# Altium project PCB_Project1.PrjPCB
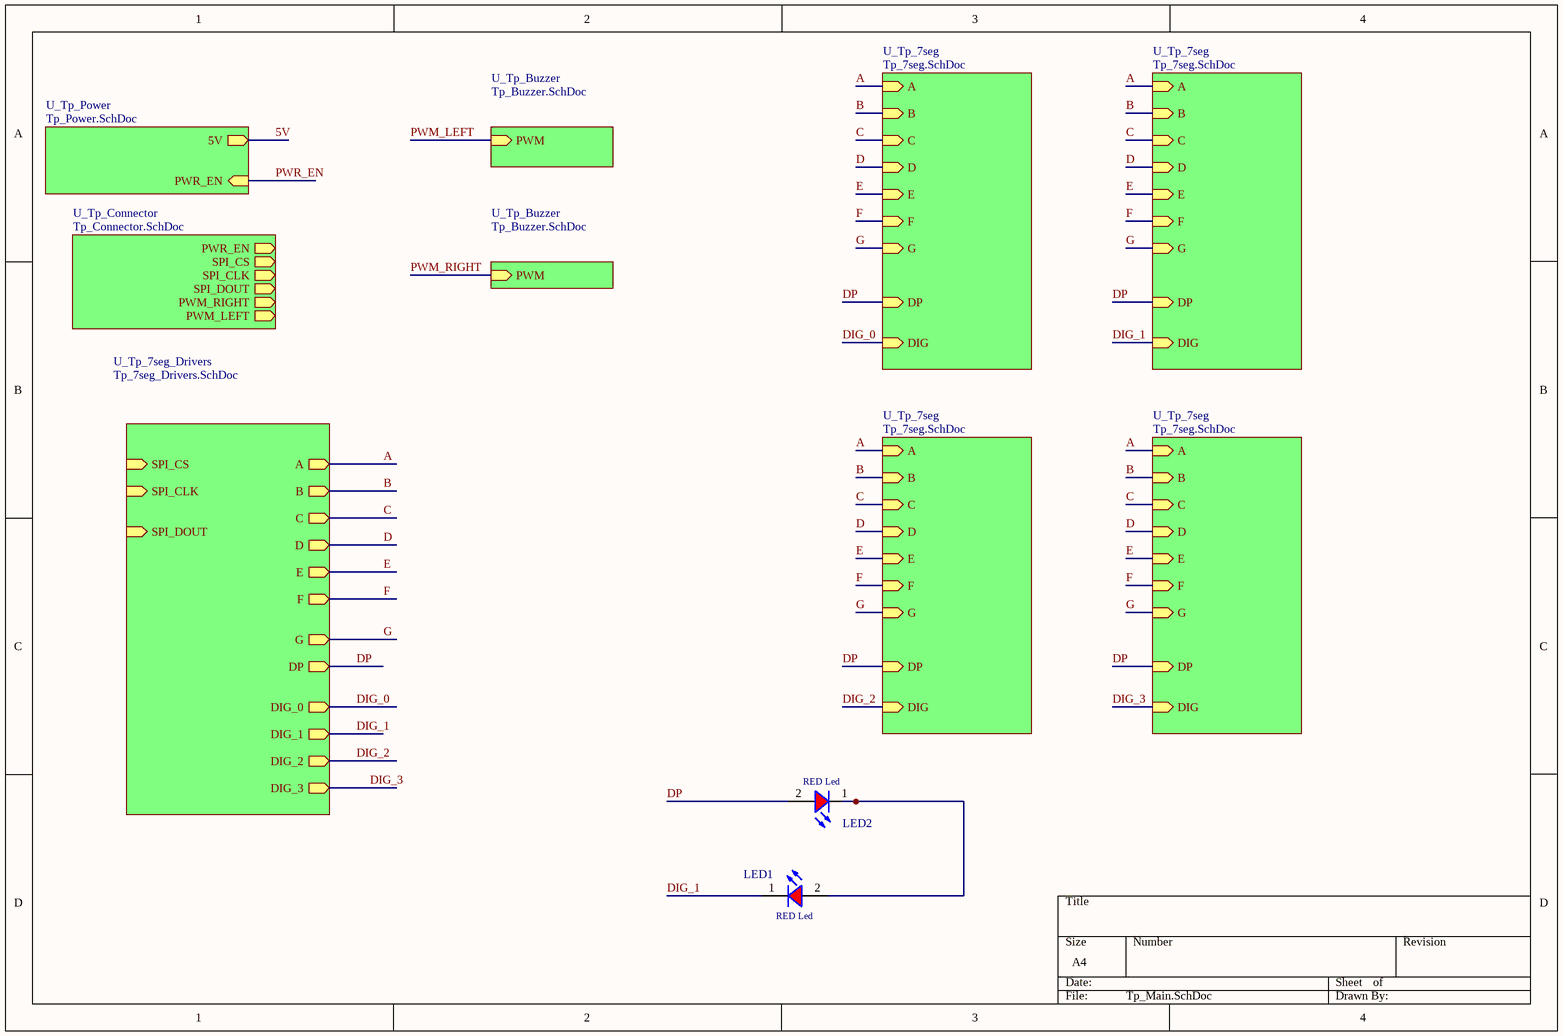
[diagram p0: Tp_Main.SchDoc]
6 sheets, 55 parts. Net scope: hierarchical (ports join the sheet entries above them; power ports are global).
Sheets:
  Tp_Main.SchDoc
    U_Tp_Buzzer = Tp_Buzzer.SchDoc
    U_Tp_7seg = Tp_7seg.SchDoc
    U_Tp_Buzzer = Tp_Buzzer.SchDoc
    U_Tp_7seg = Tp_7seg.SchDoc
    U_Tp_7seg = Tp_7seg.SchDoc
    U_Tp_7seg = Tp_7seg.SchDoc
    U_Tp_Power = Tp_Power.SchDoc
    U_Tp_7seg_Drivers = Tp_7seg_Drivers.SchDoc
    U_Tp_Connector = Tp_Connector.SchDoc

## Sheet Tp_Main.SchDoc
size A4

### Parts
LED1  RED Led  [LED_0603_RED]
LED2  RED Led  [LED_0603_RED]

### Sub-sheets
U_Tp_7seg = Tp_7seg.SchDoc: A (in), B (in), C (in), D (in), E (in), F (in), G (in), DP (in), DIG (in)
U_Tp_7seg = Tp_7seg.SchDoc: A (in), B (in), C (in), D (in), E (in), F (in), G (in), DP (in), DIG (in)
U_Tp_7seg = Tp_7seg.SchDoc: A (in), B (in), C (in), D (in), E (in), F (in), G (in), DP (in), DIG (in)
U_Tp_7seg = Tp_7seg.SchDoc: A (in), B (in), C (in), D (in), E (in), F (in), G (in), DP (in), DIG (in)
U_Tp_7seg_Drivers = Tp_7seg_Drivers.SchDoc: D (out), B (out), C (out), E (out), F (out), G (out), DP (out), A (out), DIG_0 (out), DIG_1 (out), DIG_2 (out), DIG_3 (out), SPI_CS (in), SPI_CLK (in), SPI_DOUT (in)
U_Tp_Buzzer = Tp_Buzzer.SchDoc: PWM (in)
U_Tp_Buzzer = Tp_Buzzer.SchDoc: PWM (in)
U_Tp_Connector = Tp_Connector.SchDoc: PWR_EN (out), SPI_CS (out), SPI_CLK (out), SPI_DOUT (out), PWM_RIGHT (out), PWM_LEFT (out)
U_Tp_Power = Tp_Power.SchDoc: 5V (out), PWR_EN (in)

### Nets
5V: sheet U_Tp_Power/5V
A: sheet U_Tp_7seg/A, sheet U_Tp_7seg/A, sheet U_Tp_7seg/A, sheet U_Tp_7seg/A, sheet U_Tp_7seg_Drivers/A
B: sheet U_Tp_7seg/B, sheet U_Tp_7seg/B, sheet U_Tp_7seg/B, sheet U_Tp_7seg/B, sheet U_Tp_7seg_Drivers/B
C: sheet U_Tp_7seg/C, sheet U_Tp_7seg/C, sheet U_Tp_7seg/C, sheet U_Tp_7seg/C, sheet U_Tp_7seg_Drivers/C
D: sheet U_Tp_7seg/D, sheet U_Tp_7seg/D, sheet U_Tp_7seg/D, sheet U_Tp_7seg/D, sheet U_Tp_7seg_Drivers/D
DIG_0: sheet U_Tp_7seg/DIG, sheet U_Tp_7seg_Drivers/DIG_0
DIG_1: LED1.1(K) ; sheet U_Tp_7seg/DIG, sheet U_Tp_7seg_Drivers/DIG_1
DIG_2: sheet U_Tp_7seg/DIG, sheet U_Tp_7seg_Drivers/DIG_2
DIG_3: sheet U_Tp_7seg/DIG, sheet U_Tp_7seg_Drivers/DIG_3
DP: LED2.2(A) ; sheet U_Tp_7seg/DP, sheet U_Tp_7seg/DP, sheet U_Tp_7seg/DP, sheet U_Tp_7seg/DP, sheet U_Tp_7seg_Drivers/DP
E: sheet U_Tp_7seg/E, sheet U_Tp_7seg/E, sheet U_Tp_7seg/E, sheet U_Tp_7seg/E, sheet U_Tp_7seg_Drivers/E
F: sheet U_Tp_7seg/F, sheet U_Tp_7seg/F, sheet U_Tp_7seg/F, sheet U_Tp_7seg/F, sheet U_Tp_7seg_Drivers/F
G: sheet U_Tp_7seg/G, sheet U_Tp_7seg/G, sheet U_Tp_7seg/G, sheet U_Tp_7seg/G, sheet U_Tp_7seg_Drivers/G
NetLED1_2: LED1.2(A) LED2.1(K)

### Library data of the parts
LED1 LED2 = LED_RED_SMD_WE_150060RS750x0: LED RED SMD WE 150060RS750x0; ref: 150060RS750x0

## Sheet Tp_Buzzer.SchDoc
size A4
Used 2 times, as channels U_Tp_Buzzer, U_Tp_Buzzer. Parts and nets are listed once, with the designators drawn on the sheet.
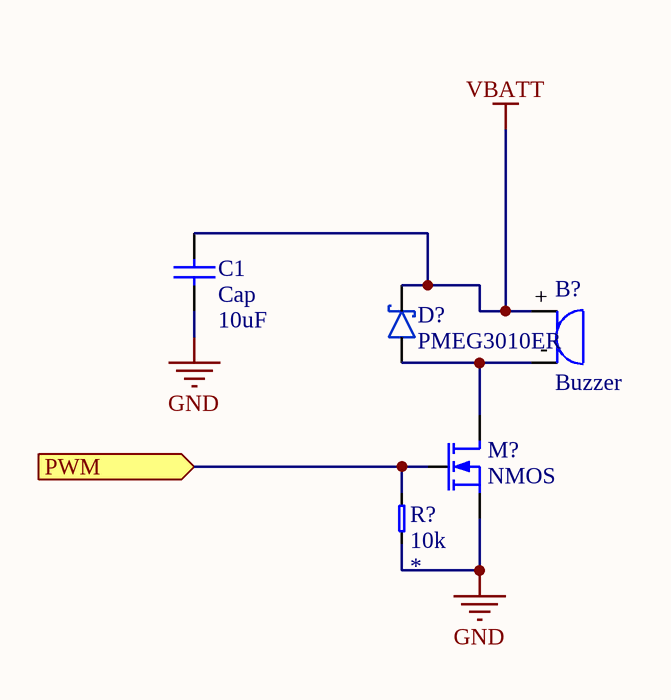
[diagram p1: Tp_Buzzer.SchDoc]

### Parts
B?  Buzzer  [SD160709]
C1  Cap  value 10uF  [RAD-0.3]
D?  PMEG3010ER  [SOD123W]
M?  NMOS  [MOSFET-SOT23]
R?  value 10k  [0603_RES_LD]  (hidden comment: Resistor)

### Ports
PWM (in)

### Nets
GND: C1.1 M?.S R?.1
VBATT: B?.+ C1.2 D?.K
PWM: M?.G R?.2 ; port PWM
NetB?_-: B?.- D?.A M?.D

### Channels
U_Tp_Buzzer: designators end in _U_Tp_Buzzer#1; ports PWM=PWM_LEFT
U_Tp_Buzzer: designators end in _U_Tp_Buzzer#2; ports PWM=PWM_RIGHT

### Library data of the parts
B? = SD160709: TDK SD160709 Buzzer; Reference: SD160709
C1 = Cap: Capacitor; Published: 8-Jun-2000; LatestRevisionDate: 17-Jul-2002; LatestRevisionNote: Re-released for DXP Platform.; PackageReference: RAD-0.3; Publisher: Altium Limited; PackageDescription: Radial Cap, Thru-Hole; 2 Leads; 0.3 in Pin Spacing
D? = Schottky_PMEG3010ER: Nexperia 1A low Vf Mega Schottky barrier rectifier; Reference: PMEG3010ER
M? = N-MOSFET: N MOSFET
R? = Resistor: Precision: *; Package: *

## Sheet Tp_7seg.SchDoc
size A4
Used 4 times, as channels U_Tp_7seg, U_Tp_7seg, U_Tp_7seg, U_Tp_7seg. Parts and nets are listed once, with the designators drawn on the sheet.
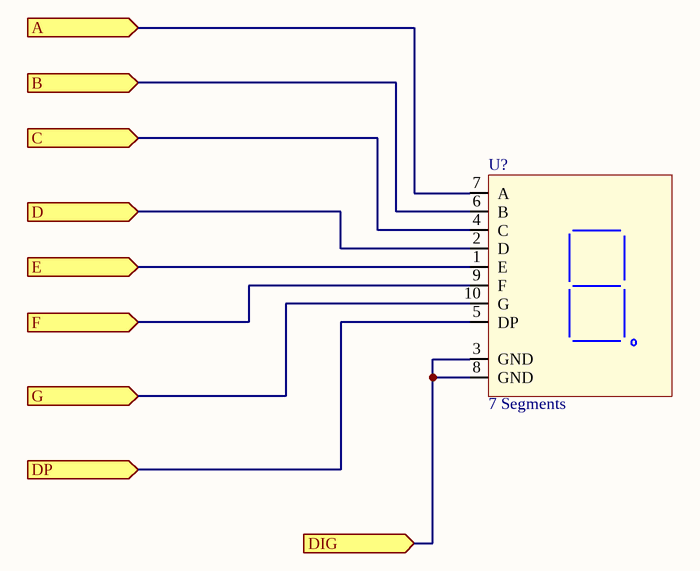
[diagram p2: Tp_7seg.SchDoc]

### Parts
U?  7 Segments  [SA10-21GWA]

### Ports
A (in), B (in), C (in), D (in), DIG (in), DP (in), E (in), F (in), G (in)

### Nets
A: U?.7(A) ; port A
B: U?.6(B) ; port B
C: U?.4(C) ; port C
D: U?.2(D) ; port D
DIG: U?.3(GND) U?.8(GND) ; port DIG
DP: U?.5(DP) ; port DP
E: U?.1(E) ; port E
F: U?.9(F) ; port F
G: U?.10(G) ; port G

### Channels
U_Tp_7seg: designators end in _U_Tp_7seg#1; ports A=A B=B C=C D=D DIG=DIG_2 DP=DP E=E F=F G=G
U_Tp_7seg: designators end in _U_Tp_7seg#2; ports A=A B=B C=C D=D DIG=DIG_1 DP=DP E=E F=F G=G
U_Tp_7seg: designators end in _U_Tp_7seg#3; ports A=A B=B C=C D=D DIG=DIG_3 DP=DP E=E F=F G=G
U_Tp_7seg: designators end in _U_Tp_7seg#4; ports A=A B=B C=C D=D DIG=DIG_0 DP=DP E=E F=F G=G

### Library data of the parts
U? = SC10-21SRWA: KingBright Led 7 Segments; Reference: SC10-21SRWA

## Sheet Tp_Power.SchDoc
size A4
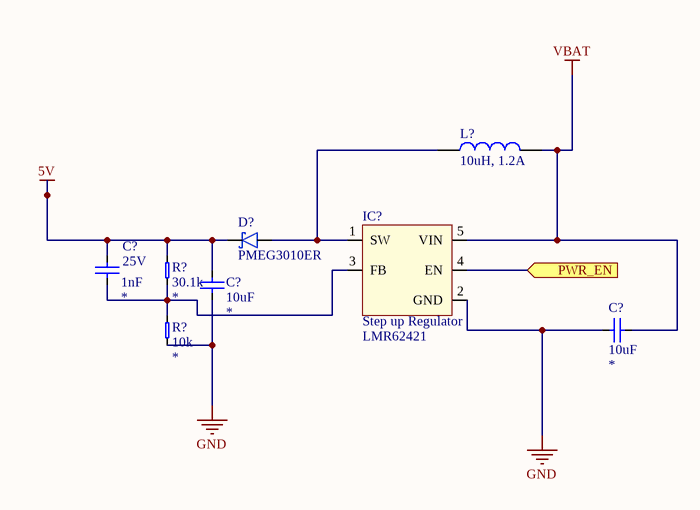
[diagram p3: Tp_Power.SchDoc]

### Parts
(Parts that share a designator on the sheet are numbered #1, #2 ... from top to bottom, then left to right.)
C?#1  value 10uF  [0603_CAP_LD]  (hidden comment: CerCap)
C?#2  value 1nF  Voltage/Power: 25V  [0603_CAP_LD]  (hidden comment: CerCap)
C?#3  value 10uF  [0603_CAP_LD]  (hidden comment: CerCap)
D?  PMEG3010ER  [SOD123W]
IC?#1  Step up Regulator  [LMR62421]
L?  10uH, 1.2A  [INDUCTOR_WE-LQS_5020]
R?#1  value 30.1k  [0603_RES_LD]  (hidden comment: Resistor)
R?#2  value 10k  [0603_RES_LD]  (hidden comment: Resistor)

### Ports
PWR_EN (in)

### Nets
5V: C?#1.2 C?#2.1 D?.K R?#1.2
GND: C?#1.1 C?#3.1 IC?#1.2(GND) R?#2.1
VBAT: C?#3.2 IC?#1.5(VIN) L?.2
PWR_EN: IC?#1.4(EN) ; port PWR_EN
NetC?#2_2: C?#2.2 IC?#1.3(FB) R?#1.1 R?#2.2
NetD?_A: D?.A IC?#1.1(SW) L?.1

### Library data of the parts
C?#1-C?#3 = CerCap: Ceramic Capacitor; Type: *; Package: *
  C?#1 C?#3: Voltage/Power: *
D? = Schottky_PMEG3010ER: as D? on sheet Tp_Buzzer; Reference: PMEG3010ER
IC?#1 = LMR62421XMF: LMR62421 simple switcher 24 Vout stepup voltage SOT-23; Reference: LMR62421
L? = INDUCTOR_74404052100: WE-LQS SMD Power Inductor, size 5020, 10uH, 1.6A; DC Resistance: 109mOhm; Inductance Tolerance: +/-20%; Saturation Current: 1.95A; Self Resonant Frequency: 37MHz; ComponentLink1Description: Manufacturer; ComponentLink1URL: http://www.we-online.de; ComponentLink2Description: Datasheet; ComponentLink2URL: https://katalog.we-online.com/pbs/datasheet/74404052100.pdf; Part Number: 74404052100; Published Date: May 2019; Publisher: Wurth Elektronik; Rated Current: 1.6A; Inductance: 10uH; Operating Temperature: -40 to +125degC; Mounting Technology: SMT; Packaging: Tape and Reel; DC Resistance Tolerance: +/-20%; Size: 5020; Reference: 74404052100
R?#1 R?#2 = Resistor: Precision: *; Package: *

## Sheet Tp_7seg_Drivers.SchDoc
size A4
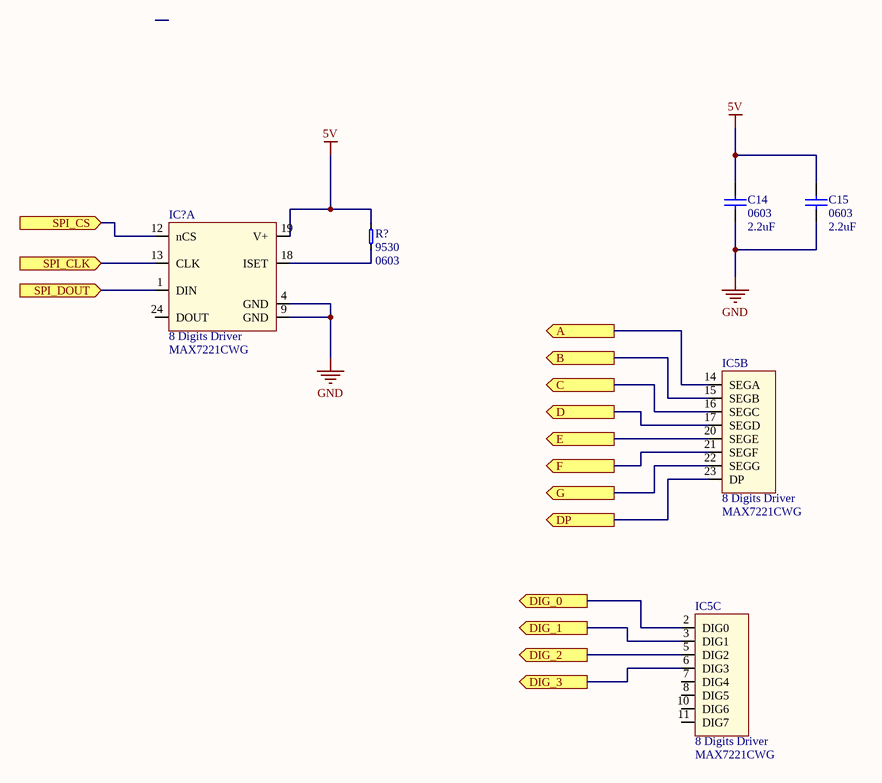
[diagram p4: Tp_7seg_Drivers.SchDoc]

### Parts
(Parts that share a designator on the sheet are numbered #1, #2 ... from top to bottom, then left to right.)
C14#1  0603  value 2.2uF  [RAD-0.3]
C15  0603  value 2.2uF  [RAD-0.3]
IC5  8 Digits Driver  [MAX7221CWG]  (parts B,C of 3)
IC?#2  8 Digits Driver  [MAX7221CWG]  (part A of 3)
R?#3  value 9530  Package: 0603  [0603_RES_LD]  (hidden comment: Resistor)

### Ports
A (out), B (out), C (out), D (out), DIG_0 (out), DIG_1 (out), DIG_2 (out), DIG_3 (out), DP (out), E (out), F (out), G (out), SPI_CLK (in), SPI_CS (in), SPI_DOUT (in)

### Nets
5V: C14#1.2 C15.2 IC?#2.19(V+) R?#3.2
GND: C14#1.1 C15.1 IC?#2.4(GND) IC?#2.9(GND)
A: IC5.14(SEGA) ; port A
B: IC5.15(SEGB) ; port B
C: IC5.16(SEGC) ; port C
D: IC5.17(SEGD) ; port D
DIG_0: IC5.2(DIG0) ; port DIG_0
DIG_1: IC5.3(DIG1) ; port DIG_1
DIG_2: IC5.5(DIG2) ; port DIG_2
DIG_3: IC5.6(DIG3) ; port DIG_3
DP: IC5.23(DP) ; port DP
E: IC5.20(SEGE) ; port E
F: IC5.21(SEGF) ; port F
G: IC5.22(SEGG) ; port G
NetIC?#2_1: IC?#2.1(DIN) ; port SPI_DOUT
NetIC?#2_12: IC?#2.12(nCS) ; port SPI_CS
NetIC?#2_13: IC?#2.13(CLK) ; port SPI_CLK
NetIC?#2_18: IC?#2.18(ISET) R?#3.1

Not connected (* = marked no-connect by the designer): IC5 7(DIG4) 8(DIG5) 10(DIG6) 11(DIG7); IC?#2 24(DOUT)

### Library data of the parts
C14#1 C15 = Cap: Capacitor; Published: 8-Jun-2000; LatestRevisionDate: 17-Jul-2002; LatestRevisionNote: Re-released for DXP Platform.; PackageReference: RAD-0.3; Publisher: Altium Limited; PackageDescription: Radial Cap, Thru-Hole; 2 Leads; 0.3 in Pin Spacing
IC5 IC?#2 = MAX7221: MAX7221 8 Digit 7 Segments Display; Reference: MAX7221CWG
R?#3 = Resistor: Precision: *

## Sheet Tp_Connector.SchDoc
size A4
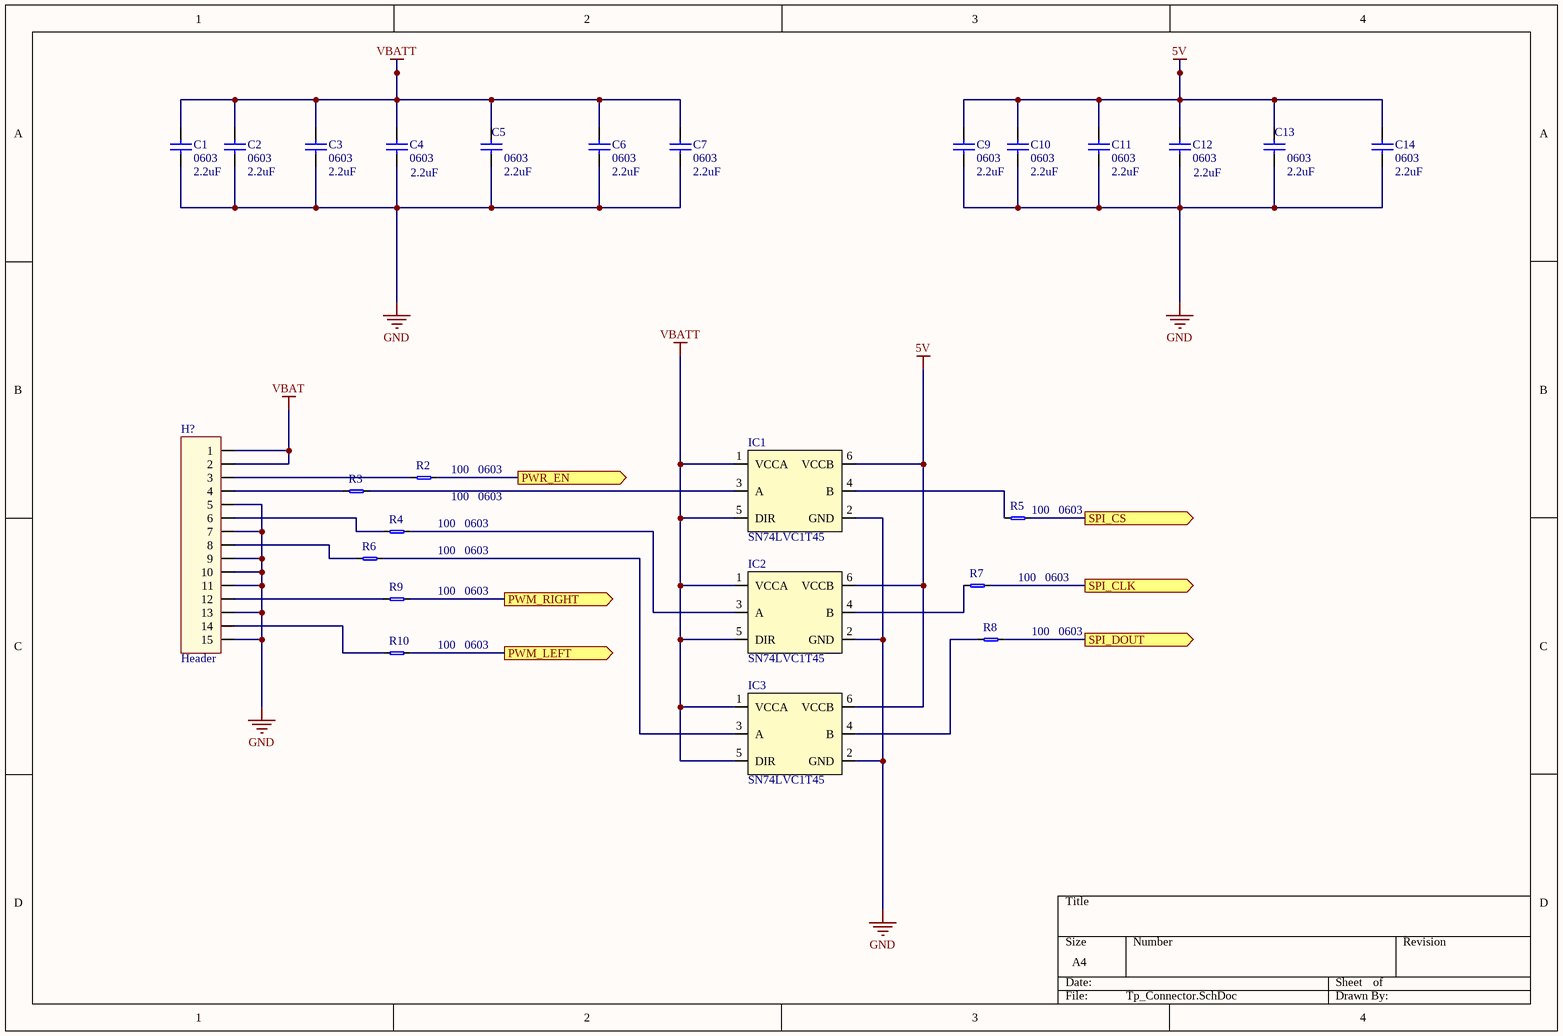
[diagram p5: Tp_Connector.SchDoc]

### Parts
(Parts that share a designator on the sheet are numbered #1, #2 ... from top to bottom, then left to right.)
C1  0603  value 2.2uF  [RAD-0.3]
C2  0603  value 2.2uF  [RAD-0.3]
C3  0603  value 2.2uF  [RAD-0.3]
C4  0603  value 2.2uF  [RAD-0.3]
C5  0603  value 2.2uF  [RAD-0.3]
C6  0603  value 2.2uF  [RAD-0.3]
C7  0603  value 2.2uF  [RAD-0.3]
C9  0603  value 2.2uF  [RAD-0.3]
C10  0603  value 2.2uF  [RAD-0.3]
C11  0603  value 2.2uF  [RAD-0.3]
C12  0603  value 2.2uF  [RAD-0.3]
C13  0603  value 2.2uF  [RAD-0.3]
C14#2  0603  value 2.2uF  [RAD-0.3]
H?  Header  [653115131822]
IC1  SN74LVC1T45  [MO-203AB_LD]
IC2  SN74LVC1T45  [MO-203AB_LD]
IC3  SN74LVC1T45  [MO-203AB_LD]
R2  value 100  Package: 0603  [0402_RES_LD]  (hidden comment: Resistor)
R3  value 100  Package: 0603  [0402_RES_LD]  (hidden comment: Resistor)
R4  value 100  Package: 0603  [0402_RES_LD]  (hidden comment: Resistor)
R5  value 100  Package: 0603  [0402_RES_LD]  (hidden comment: Resistor)
R6  value 100  Package: 0603  [0402_RES_LD]  (hidden comment: Resistor)
R7  value 100  Package: 0603  [0402_RES_LD]  (hidden comment: Resistor)
R8  value 100  Package: 0603  [0402_RES_LD]  (hidden comment: Resistor)
R9  value 100  Package: 0603  [0402_RES_LD]  (hidden comment: Resistor)
R10  value 100  Package: 0603  [0402_RES_LD]  (hidden comment: Resistor)

### Ports
PWM_LEFT (out), PWM_RIGHT (out), PWR_EN (out), SPI_CLK (out), SPI_CS (out), SPI_DOUT (out)

### Nets
5V: C9.2 C10.2 C11.2 C12.2 C13.2 C14#2.2 IC1.6(VCCB) IC2.6(VCCB) IC3.6(VCCB)
GND: C1.1 C2.1 C3.1 C4.1 C5.1 C6.1 C7.1 C9.1 C10.1 C11.1 C12.1 C13.1 C14#2.1 H?.5 H?.7 H?.9 H?.10 H?.11 H?.13 H?.15 IC1.2(GND) IC2.2(GND) IC3.2(GND)
VBAT: H?.1 H?.2
VBATT: C1.2 C2.2 C3.2 C4.2 C5.2 C6.2 C7.2 IC1.1(VCCA) IC1.5(DIR) IC2.1(VCCA) IC2.5(DIR) IC3.1(VCCA) IC3.5(DIR)
NetH?_3: H?.3 R2.1
NetH?_4: H?.4 R3.1
NetH?_6: H?.6 R4.1
NetH?_8: H?.8 R6.1
NetH?_12: H?.12 R9.1
NetH?_14: H?.14 R10.1
NetIC1_3: IC1.3(A) R3.2
NetIC1_4: IC1.4(B) R5.1
NetIC2_3: IC2.3(A) R4.2
NetIC2_4: IC2.4(B) R7.1
NetIC3_3: IC3.3(A) R6.2
NetIC3_4: IC3.4(B) R8.1
NetR2_2: R2.2 ; port PWR_EN
NetR5_2: R5.2 ; port SPI_CS
NetR7_2: R7.2 ; port SPI_CLK
NetR8_2: R8.2 ; port SPI_DOUT
NetR9_2: R9.2 ; port PWM_RIGHT
NetR10_2: R10.2 ; port PWM_LEFT

### Library data of the parts
C1-C7 C9-C13 C14#2 = Cap: Capacitor; Published: 8-Jun-2000; LatestRevisionDate: 17-Jul-2002; LatestRevisionNote: Re-released for DXP Platform.; PackageReference: RAD-0.3; Publisher: Altium Limited; PackageDescription: Radial Cap, Thru-Hole; 2 Leads; 0.3 in Pin Spacing
H? = HEADER_15x1: Header 15x1
IC1-IC3 = SN74LVC1T45: Single Bit Dual Supply Buffer
R2-R10 = Resistor: Precision: *

## Nets that join several sheets
5V: Tp_Power (C?#1.2 C?#2.1 D?.K R?#1.2), Tp_7seg_Drivers (C14#1.2 C15.2 IC?#2.19 R?#3.2), Tp_Connector (9 pins)
GND: U_Tp_Buzzer (C1_U_Tp_Buzzer#1.1 M?_U_Tp_Buzzer#1.S R?_U_Tp_Buzzer#1.1), U_Tp_Buzzer (C1_U_Tp_Buzzer#2.1 M?_U_Tp_Buzzer#2.S R?_U_Tp_Buzzer#2.1), Tp_Power (C?#1.1 C?#3.1 IC?#1.2 R?#2.1), Tp_7seg_Drivers (C14#1.1 C15.1 IC?#2.4 IC?#2.9), Tp_Connector (23 pins)
VBAT: Tp_Power (C?#3.2 IC?#1.5 L?.2), Tp_Connector (H?.1 H?.2)
VBATT: U_Tp_Buzzer (B?_U_Tp_Buzzer#1.+ C1_U_Tp_Buzzer#1.2 D?_U_Tp_Buzzer#1.K), U_Tp_Buzzer (B?_U_Tp_Buzzer#2.+ C1_U_Tp_Buzzer#2.2 D?_U_Tp_Buzzer#2.K), Tp_Connector (13 pins)
A: U_Tp_7seg (U?_U_Tp_7seg#1.7), U_Tp_7seg (U?_U_Tp_7seg#2.7), U_Tp_7seg (U?_U_Tp_7seg#3.7), U_Tp_7seg (U?_U_Tp_7seg#4.7), Tp_7seg_Drivers (IC5.14)
B: U_Tp_7seg (U?_U_Tp_7seg#1.6), U_Tp_7seg (U?_U_Tp_7seg#2.6), U_Tp_7seg (U?_U_Tp_7seg#3.6), U_Tp_7seg (U?_U_Tp_7seg#4.6), Tp_7seg_Drivers (IC5.15)
C: U_Tp_7seg (U?_U_Tp_7seg#1.4), U_Tp_7seg (U?_U_Tp_7seg#2.4), U_Tp_7seg (U?_U_Tp_7seg#3.4), U_Tp_7seg (U?_U_Tp_7seg#4.4), Tp_7seg_Drivers (IC5.16)
D: U_Tp_7seg (U?_U_Tp_7seg#1.2), U_Tp_7seg (U?_U_Tp_7seg#2.2), U_Tp_7seg (U?_U_Tp_7seg#3.2), U_Tp_7seg (U?_U_Tp_7seg#4.2), Tp_7seg_Drivers (IC5.17)
DIG_0: U_Tp_7seg (U?_U_Tp_7seg#4.3 U?_U_Tp_7seg#4.8), Tp_7seg_Drivers (IC5.2)
DIG_1: Tp_Main (LED1.1), U_Tp_7seg (U?_U_Tp_7seg#2.3 U?_U_Tp_7seg#2.8), Tp_7seg_Drivers (IC5.3)
DIG_2: U_Tp_7seg (U?_U_Tp_7seg#1.3 U?_U_Tp_7seg#1.8), Tp_7seg_Drivers (IC5.5)
DIG_3: U_Tp_7seg (U?_U_Tp_7seg#3.3 U?_U_Tp_7seg#3.8), Tp_7seg_Drivers (IC5.6)
DP: Tp_Main (LED2.2), U_Tp_7seg (U?_U_Tp_7seg#1.5), U_Tp_7seg (U?_U_Tp_7seg#2.5), U_Tp_7seg (U?_U_Tp_7seg#3.5), U_Tp_7seg (U?_U_Tp_7seg#4.5), Tp_7seg_Drivers (IC5.23)
E: U_Tp_7seg (U?_U_Tp_7seg#1.1), U_Tp_7seg (U?_U_Tp_7seg#2.1), U_Tp_7seg (U?_U_Tp_7seg#3.1), U_Tp_7seg (U?_U_Tp_7seg#4.1), Tp_7seg_Drivers (IC5.20)
F: U_Tp_7seg (U?_U_Tp_7seg#1.9), U_Tp_7seg (U?_U_Tp_7seg#2.9), U_Tp_7seg (U?_U_Tp_7seg#3.9), U_Tp_7seg (U?_U_Tp_7seg#4.9), Tp_7seg_Drivers (IC5.21)
G: U_Tp_7seg (U?_U_Tp_7seg#1.10), U_Tp_7seg (U?_U_Tp_7seg#2.10), U_Tp_7seg (U?_U_Tp_7seg#3.10), U_Tp_7seg (U?_U_Tp_7seg#4.10), Tp_7seg_Drivers (IC5.22)